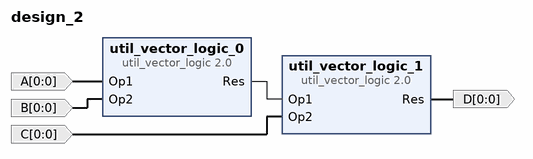
[diagram p0: block diagram of the top level]
# Vivado block design design_2, xc7a100tcsg324-1, Vivado 2021.1
create_bd_design design_2

create_bd_port -dir O -from 0 -to 0 D
create_bd_port -dir I -from 0 -to 0 A
create_bd_port -dir I -from 0 -to 0 B
create_bd_port -dir I -from 0 -to 0 C

create_bd_cell -type ip -vlnv xilinx.com:ip:util_vector_logic:2.0 util_vector_logic_0
set_property -dict {CONFIG.C_SIZE 1} [get_bd_cells util_vector_logic_0]
create_bd_cell -type ip -vlnv xilinx.com:ip:util_vector_logic:2.0 util_vector_logic_1
set_property -dict {CONFIG.C_OPERATION or CONFIG.C_SIZE 1} [get_bd_cells util_vector_logic_1]

# ---- connections ----

connect_bd_net [get_bd_ports A] [get_bd_pins util_vector_logic_0/Op1]
connect_bd_net [get_bd_ports B] [get_bd_pins util_vector_logic_0/Op2]
connect_bd_net [get_bd_ports C] [get_bd_pins util_vector_logic_1/Op2]
connect_bd_net [get_bd_pins util_vector_logic_0/Res] [get_bd_pins util_vector_logic_1/Op1]
connect_bd_net [get_bd_pins util_vector_logic_1/Res] [get_bd_ports D]

validate_bd_design
save_bd_design
